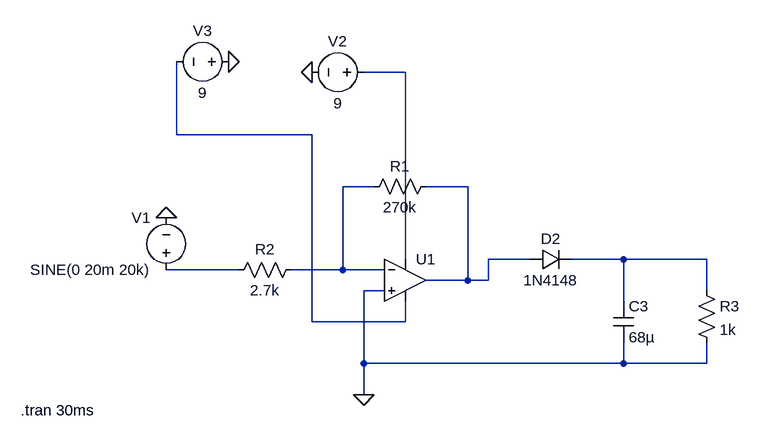
[diagram p0: schematic Peak detector circuit update.asc]
Peak detector circuit update.asc, the LTspice schematic file:
Version 4.1
SHEET 1 2516 728
WIRE 400 -400 336 -400
WIRE 48 -304 48 -416
WIRE 256 -304 48 -304
WIRE 352 -224 304 -224
WIRE 496 -224 432 -224
WIRE 400 -112 400 -400
WIRE 592 -112 528 -112
WIRE 736 -112 656 -112
WIRE 864 -112 736 -112
WIRE 144 -96 32 -96
WIRE 304 -96 304 -224
WIRE 304 -96 224 -96
WIRE 368 -96 304 -96
WIRE 496 -80 496 -224
WIRE 496 -80 432 -80
WIRE 528 -80 528 -112
WIRE 528 -80 496 -80
WIRE 368 -64 336 -64
WIRE 864 -64 864 -112
WIRE 736 -48 736 -112
WIRE 256 -16 256 -304
WIRE 400 -16 400 -48
WIRE 400 -16 256 -16
WIRE 336 48 336 -64
WIRE 736 48 736 16
WIRE 736 48 336 48
WIRE 864 48 864 16
WIRE 864 48 736 48
WIRE 336 96 336 48
FLAG 32 -176 0
FLAG 336 96 0
FLAG 256 -400 0
FLAG 128 -416 0
SYMBOL OpAmps\\UniversalOpAmp2 400 -80 R0
SYMATTR InstName U1
SYMBOL res 240 -112 R90
WINDOW 0 0 56 VBottom 2
WINDOW 3 32 56 VTop 2
SYMATTR InstName R2
SYMATTR Value 2.7k
SYMBOL voltage 352 -400 R90
WINDOW 0 -32 56 VBottom 2
WINDOW 3 32 56 VTop 2
WINDOW 123 0 0 Left 0
WINDOW 39 0 0 Left 0
SYMATTR InstName V2
SYMATTR Value 9
SYMBOL voltage 32 -80 R180
WINDOW 0 24 96 Left 2
WINDOW 3 24 16 Left 2
WINDOW 123 0 0 Left 0
WINDOW 39 0 0 Left 0
SYMATTR InstName V1
SYMATTR Value SINE(0 20m 20k)
SYMBOL res 448 -240 R90
WINDOW 0 0 56 VBottom 2
WINDOW 3 32 56 VTop 2
SYMATTR InstName R1
SYMATTR Value 270k
SYMBOL diode 592 -96 R270
WINDOW 0 32 32 VTop 2
WINDOW 3 0 32 VBottom 2
SYMATTR InstName D2
SYMATTR Value 1N4148
SYMBOL cap 720 -48 R0
SYMATTR InstName C3
SYMATTR Value 68µ
SYMBOL voltage 144 -416 R90
WINDOW 0 -32 56 VBottom 2
WINDOW 3 32 56 VTop 2
WINDOW 123 0 0 Left 0
WINDOW 39 0 0 Left 0
SYMATTR InstName V3
SYMATTR Value 9
SYMBOL res 848 -80 R0
SYMATTR InstName R3
SYMATTR Value 1k
TEXT -192 120 Left 2 !.tran 30ms

The netlist it stands for:
* Peak detector circuit update.asc
X§U1 0 N003 N001 N002 N004 level2 Avol=1Meg GBW=10Meg Slew=10Meg Ilimit=25m Rail=0 Vos=0 En=0 Enk=0 In=0 Ink=0 Rin=500Meg  ; pins In+ In- V+ V- OUT
R2 N003 N006 2.7k
V2 N001 0 9
V1 N006 0 SINE(0 20m 20k)
R1 N004 N003 270k
D2 N004 N005 1N4148
C3 N005 0 68µ
V3 0 N002 9
R3 N005 0 1k
.model D D
.lib standard.dio
.tran 30ms
.lib UniversalOpAmp2.lib
.backanno
.end